# EAGLE design TPLE (EAGLE 5.06)
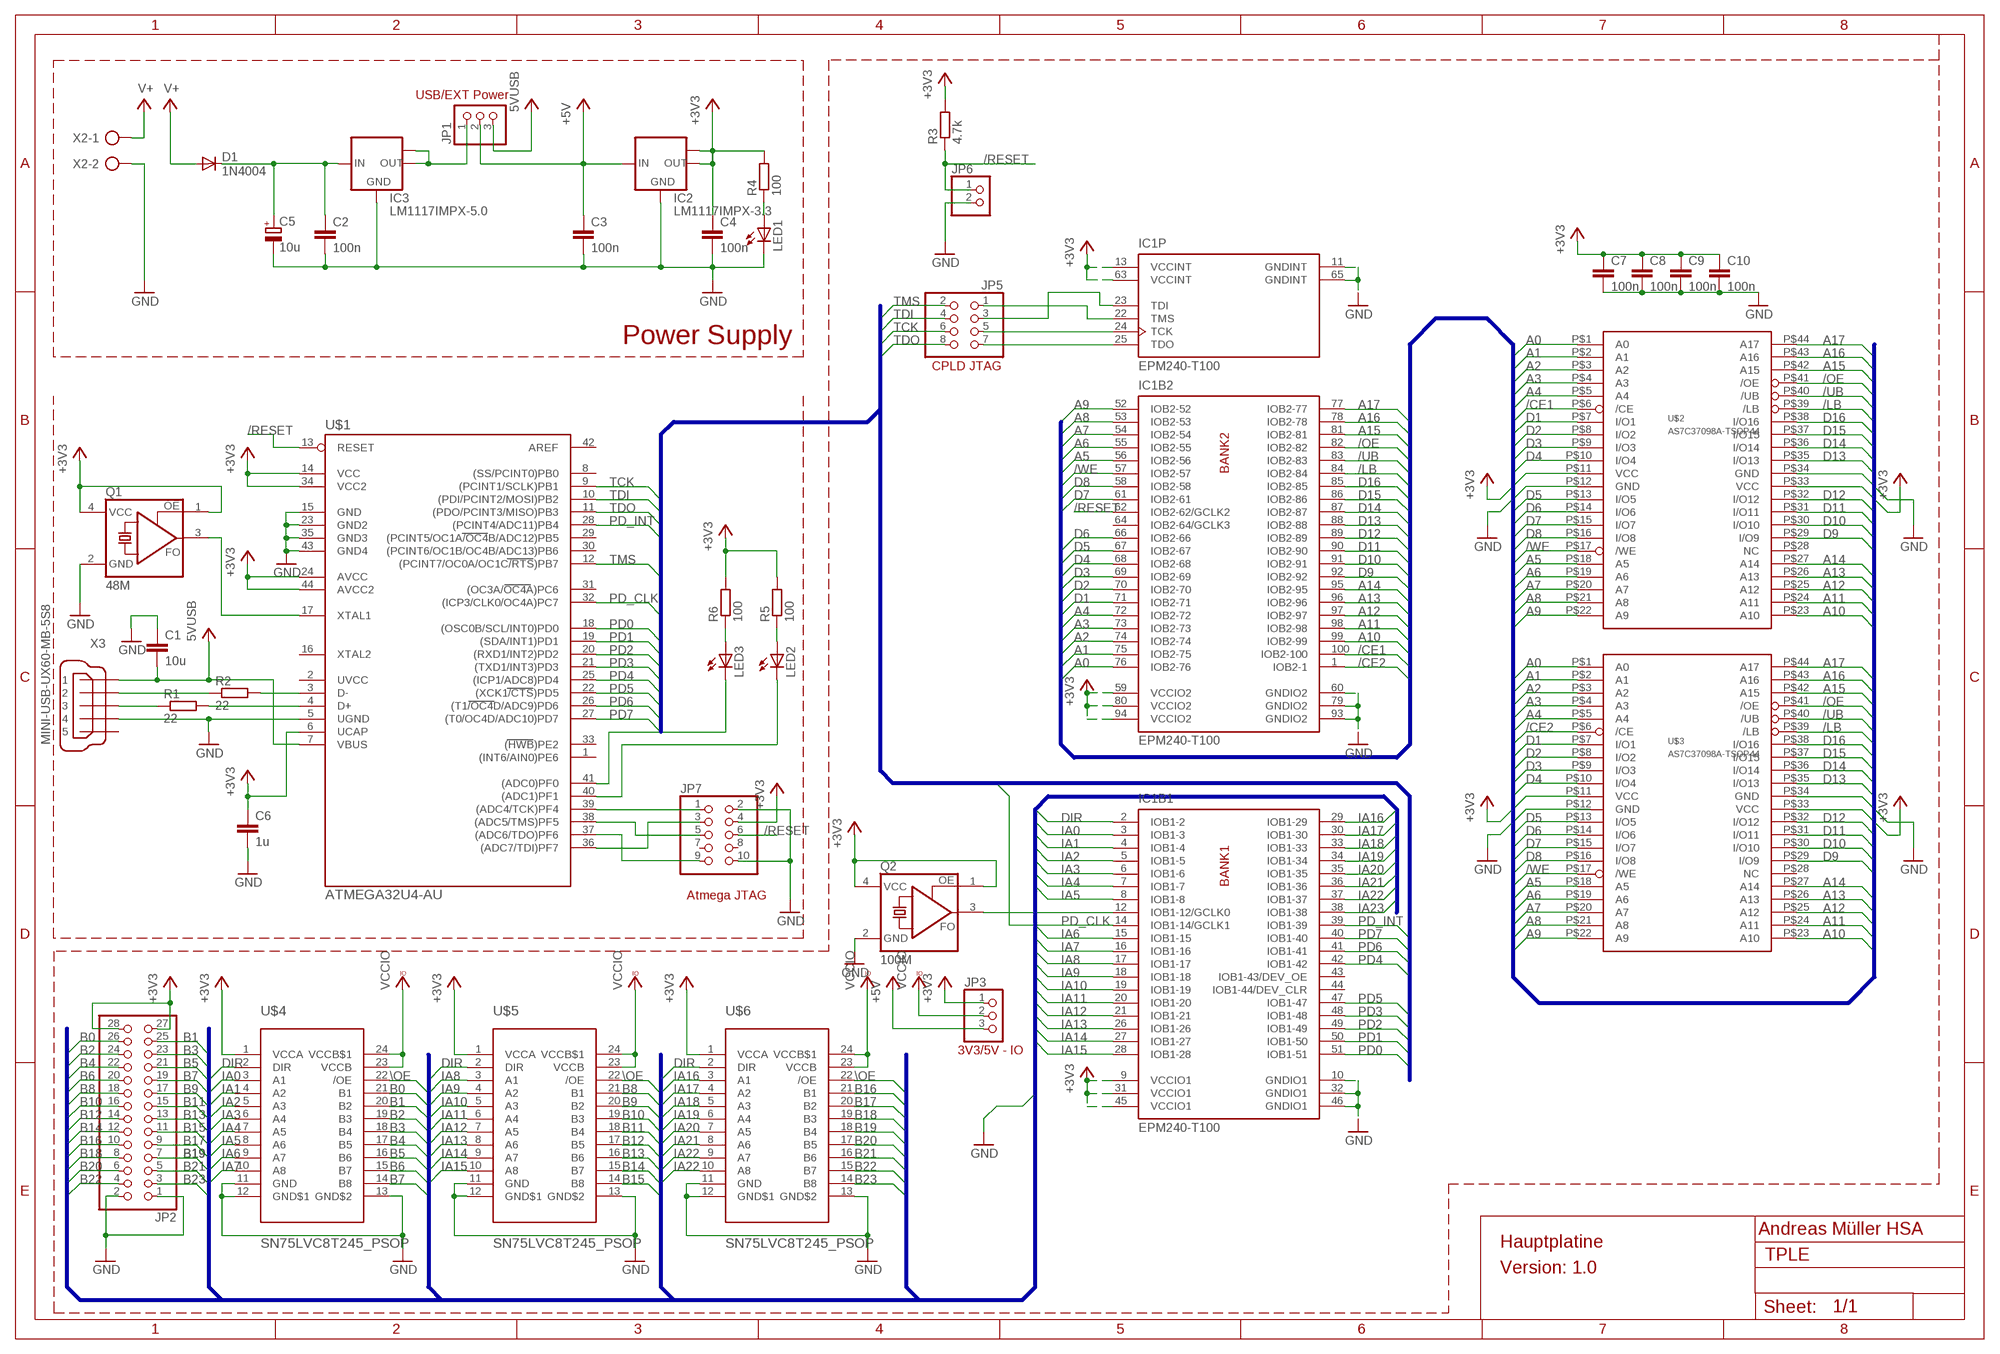
[diagram p0: schematic, sheet 1]

## Parts
C1  10u  C-EUC3216  [C3216]
C2  100n  C-EUC1206  [C1206]
C3  100n  C-EUC1206  [C1206]
C4  100n  C-EUC1206  [C1206]
C5  10u  CPOL-EU153CLV-1012  [153CLV-1012]
C6  1u  C-EUC0402  [C0402]
C7  100n  C-EUC0402  [C0402]
C8  100n  C-EUC0402  [C0402]
C9  100n  C-EUC0402  [C0402]
C10  100n  C-EUC0402  [C0402]
D1  1N4004  [DO41-10]
IC1  EPM240-T100  [TQFP100]
IC2  LM1117IMPX-3.3  [SOT223]
IC3  LM1117IMPX-5.0  [SOT223]
JP1  PINHD-1X3  [1X03]
JP2  PINHD-2X14  [2X14]
JP3  PINHD-1X3  [1X03]
JP5  PINHD-2X4  [2X04]
JP6  PINHD-1X2  [1X02]
JP7  PINHD-2X5  [2X05]
LED1  LEDSMT1206  [1206]
LED2  LEDSMT1206  [1206]
LED3  LEDSMT1206  [1206]
Q1  48M  ASFL1  [ASF]
Q2  100M  ASFL1  [ASF]
R1  22  R-EU_M3216  [M3216]
R2  22  R-EU_M3216  [M3216]
R3  4.7k  R-EU_M3216  [M3216]
R4  100  R-EU_M3216  [M3216]
R5  100  R-EU_M3216  [M3216]
R6  100  R-EU_M3216  [M3216]
U$1  ATMEGA32U4-AU  [TQFP44]
U$2  AS7C37098A-TSOP44  [TSOP2-44]
U$3  AS7C37098A-TSOP44  [TSOP2-44]
U$4  SN75LVC8T245_PSOP  [SOP24]
U$5  SN75LVC8T245_PSOP  [SOP24]
U$6  SN75LVC8T245_PSOP  [SOP24]
X2  AK300/2  [AK300/2]
X3  MINI-USB-UX60-MB-5S8  [UX60-MB-5S8]

## Nets
+3V3: C4.1 C6.1 C7.1 C8.1 C9.1 C10.1 IC1.9(B1:VCCIO1) IC1.13(P:VCCINT) IC1.31(B1:VCCIO1) IC1.45(B1:VCCIO1) IC1.59(B2:VCCIO2) IC1.63(P:VCCINT) IC1.80(B2:VCCIO2) IC1.94(B2:VCCIO2) IC2.2(OUT) IC2.TAB(OUT1) JP2.27 JP2.28 JP3.1 JP7.4 Q1.1(OE) Q1.4(VCC) Q2.1(OE) Q2.4(VCC) R3.2 R4.2 R5.2 R6.2 U$1.6(UCAP) U$1.14(VCC) U$1.24(AVCC) U$1.34(VCC2) U$1.44(AVCC2) U$2.P$11(VCC) U$2.P$33(VCC) U$3.P$11(VCC) U$3.P$33(VCC) U$4.1(VCCA) U$5.1(VCCA) U$6.1(VCCA)
+5V: C3.1 IC2.3(IN) JP1.2 JP3.3
/CE1: IC1.100(B2:IOB2-100) U$2.P$6(/CE)
/CE2: IC1.1(B2:IOB2-1) U$3.P$6(/CE)
/LB: IC1.84(B2:IOB2-84) U$2.P$39(/LB) U$3.P$39(/LB)
/OE: IC1.82(B2:IOB2-82) U$2.P$41(/OE) U$3.P$41(/OE)
/RESET: IC1.62(B2:IOB2-62/GCLK2) JP6.1 JP7.6 R3.1 U$1.13(RESET)
/UB: IC1.83(B2:IOB2-83) U$2.P$40(/UB) U$3.P$40(/UB)
/WE: IC1.57(B2:IOB2-57) U$2.P$17(/WE) U$3.P$17(/WE)
\OE: U$4.22(/OE) U$5.22(/OE) U$6.22(/OE)
A0: IC1.76(B2:IOB2-76) U$2.P$1(A0) U$3.P$1(A0)
A1: IC1.75(B2:IOB2-75) U$2.P$2(A1) U$3.P$2(A1)
A2: IC1.74(B2:IOB2-74) U$2.P$3(A2) U$3.P$3(A2)
A3: IC1.73(B2:IOB2-73) U$2.P$4(A3) U$3.P$4(A3)
A4: IC1.72(B2:IOB2-72) U$2.P$5(A4) U$3.P$5(A4)
A5: IC1.56(B2:IOB2-56) U$2.P$18(A5) U$3.P$18(A5)
A6: IC1.55(B2:IOB2-55) U$2.P$19(A6) U$3.P$19(A6)
A7: IC1.54(B2:IOB2-54) U$2.P$20(A7) U$3.P$20(A7)
A8: IC1.53(B2:IOB2-53) U$2.P$21(A8) U$3.P$21(A8)
A9: IC1.52(B2:IOB2-52) U$2.P$22(A9) U$3.P$22(A9)
A10: IC1.99(B2:IOB2-99) U$2.P$23(A10) U$3.P$23(A10)
A11: IC1.98(B2:IOB2-98) U$2.P$24(A11) U$3.P$24(A11)
A12: IC1.97(B2:IOB2-97) U$2.P$25(A12) U$3.P$25(A12)
A13: IC1.96(B2:IOB2-96) U$2.P$26(A13) U$3.P$26(A13)
A14: IC1.95(B2:IOB2-95) U$2.P$27(A14) U$3.P$27(A14)
A15: IC1.81(B2:IOB2-81) U$2.P$42(A15) U$3.P$42(A15)
A16: IC1.78(B2:IOB2-78) U$2.P$43(A16) U$3.P$43(A16)
A17: IC1.77(B2:IOB2-77) U$2.P$44(A17) U$3.P$44(A17)
B0: JP2.26 U$4.21(B1)
B1: JP2.25 U$4.20(B2)
B2: JP2.24 U$4.19(B3)
B3: JP2.23 U$4.18(B4)
B4: JP2.22 U$4.17(B5)
B5: JP2.21 U$4.16(B6)
B6: JP2.20 U$4.15(B7)
B7: JP2.19 U$4.14(B8)
B8: JP2.18 U$5.21(B1)
B9: JP2.17 U$5.20(B2)
B10: JP2.16 U$5.19(B3)
B11: JP2.15 U$5.18(B4)
B12: JP2.14 U$5.17(B5)
B13: JP2.13 U$5.16(B6)
B14: JP2.12 U$5.15(B7)
B15: JP2.11 U$5.14(B8)
B16: JP2.10 U$6.21(B1)
B17: JP2.9 U$6.20(B2)
B18: JP2.8 U$6.19(B3)
B19: JP2.7 U$6.18(B4)
B20: JP2.6 U$6.17(B5)
B21: JP2.5 U$6.16(B6)
B22: JP2.4 U$6.15(B7)
B23: JP2.3 U$6.14(B8)
D1: IC1.71(B2:IOB2-71) U$2.P$7(I/O1) U$3.P$7(I/O1)
D2: IC1.70(B2:IOB2-70) U$2.P$8(I/O2) U$3.P$8(I/O2)
D3: IC1.69(B2:IOB2-69) U$2.P$9(I/O3) U$3.P$9(I/O3)
D4: IC1.68(B2:IOB2-68) U$2.P$10(I/O4) U$3.P$10(I/O4)
D5: IC1.67(B2:IOB2-67) U$2.P$13(I/O5) U$3.P$13(I/O5)
D6: IC1.66(B2:IOB2-66) U$2.P$14(I/O6) U$3.P$14(I/O6)
D7: IC1.61(B2:IOB2-61) U$2.P$15(I/O7) U$3.P$15(I/O7)
D8: IC1.58(B2:IOB2-58) U$2.P$16(I/O8) U$3.P$16(I/O8)
D9: IC1.92(B2:IOB2-92) U$2.P$29(I/O9) U$3.P$29(I/O9)
D10: IC1.91(B2:IOB2-91) U$2.P$30(I/O10) U$3.P$30(I/O10)
D11: IC1.90(B2:IOB2-90) U$2.P$31(I/O11) U$3.P$31(I/O11)
D12: IC1.89(B2:IOB2-89) U$2.P$32(I/O12) U$3.P$32(I/O12)
D13: IC1.88(B2:IOB2-88) U$2.P$35(I/O13) U$3.P$35(I/O13)
D14: IC1.87(B2:IOB2-87) U$2.P$36(I/O14) U$3.P$36(I/O14)
D15: IC1.86(B2:IOB2-86) U$2.P$37(I/O15) U$3.P$37(I/O15)
D16: IC1.85(B2:IOB2-85) U$2.P$38(I/O16) U$3.P$38(I/O16)
DIR: IC1.2(B1:IOB1-2) U$4.2(DIR) U$5.2(DIR) U$6.2(DIR)
GND: C1.1 C2.2 C3.2 C4.2 C5.- C6.2 C7.2 C8.2 C9.2 C10.2 IC1.10(B1:GNDIO1) IC1.11(P:GNDINT) IC1.32(B1:GNDIO1) IC1.46(B1:GNDIO1) IC1.60(B2:GNDIO2) IC1.65(P:GNDINT) IC1.79(B2:GNDIO2) IC1.93(B2:GNDIO2) IC2.1(GND) IC3.1(GND) JP2.1 JP2.2 JP6.2 JP7.2 JP7.10 LED1.C Q1.2(GND) Q2.2(GND) U$1.5(UGND) U$1.15(GND) U$1.23(GND2) U$1.35(GND3) U$1.43(GND4) U$2.P$12(GND) U$2.P$34(GND) U$3.P$34(GND) U$4.11(GND) U$4.12(GND$1) U$4.13(GND$2) U$5.11(GND) U$5.12(GND$1) U$5.13(GND$2) U$6.11(GND) U$6.12(GND$1) U$6.13(GND$2) X2.2 X3.4
IA0: IC1.3(B1:IOB1-3) U$4.3(A1)
IA1: IC1.4(B1:IOB1-4) U$4.4(A2)
IA2: IC1.5(B1:IOB1-5) U$4.5(A3)
IA3: IC1.6(B1:IOB1-6) U$4.6(A4)
IA4: IC1.7(B1:IOB1-7) U$4.7(A5)
IA5: IC1.8(B1:IOB1-8) U$4.8(A6)
IA6: IC1.15(B1:IOB1-15) U$4.9(A7)
IA7: IC1.16(B1:IOB1-16) U$4.10(A8)
IA8: IC1.17(B1:IOB1-17) U$5.3(A1)
IA9: IC1.18(B1:IOB1-18) U$5.4(A2)
IA10: IC1.19(B1:IOB1-19) U$5.5(A3)
IA11: IC1.20(B1:IOB1-20) U$5.6(A4)
IA12: IC1.21(B1:IOB1-21) U$5.7(A5)
IA13: IC1.26(B1:IOB1-26) U$5.8(A6)
IA14: IC1.27(B1:IOB1-27) U$5.9(A7)
IA15: IC1.28(B1:IOB1-28) U$5.10(A8)
IA16: IC1.29(B1:IOB1-29) U$6.3(A1)
IA17: IC1.30(B1:IOB1-30) U$6.4(A2)
IA18: IC1.33(B1:IOB1-33) U$6.5(A3)
IA19: IC1.34(B1:IOB1-34) U$6.6(A4)
IA20: IC1.35(B1:IOB1-35) U$6.7(A5)
IA21: IC1.36(B1:IOB1-36) U$6.8(A6)
IA22: IC1.37(B1:IOB1-37) U$6.9(A7)
IA23: IC1.38(B1:IOB1-38) U$6.10(A8)
N$2: R2.1 X3.2
N$3: R2.2 U$1.3(D-)
N$4: R1.1 X3.3
N$5: R1.2 U$1.4(D+)
N$6: IC3.2(OUT) IC3.TAB(OUT1) JP1.1
N$7: IC1.23(P:TDI) JP5.3
N$8: C2.1 C5.+ D1.C IC3.3(IN)
N$9: IC1.22(P:TMS) JP5.1
N$10: IC1.24(P:TCK) JP5.5
N$11: IC1.25(P:TDO) JP5.7
N$13: JP7.1 U$1.39((ADC4/TCK)PF4)
N$14: JP7.3 U$1.36((ADC7/TDI)PF7)
N$15: JP7.5 U$1.38((ADC5/TMS)PF5)
N$16: JP7.9 U$1.37((ADC6/TDO)PF6)
N$23: Q1.3(FO) U$1.17(XTAL1)
N$24: IC1.12(B1:IOB1-12/GCLK0) Q2.3(FO)
N$25: LED1.A R4.1
N$26: LED2.C U$1.40((ADC1)PF1)
N$27: LED3.C U$1.41((ADC0)PF0)
N$28: LED2.A R5.1
N$29: LED3.A R6.1
PD0: IC1.51(B1:IOB1-51) U$1.18((OSC0B/SCL/INT0)PD0)
PD1: IC1.50(B1:IOB1-50) U$1.19((SDA/INT1)PD1)
PD2: IC1.49(B1:IOB1-49) U$1.20((RXD1/INT2)PD2)
PD3: IC1.48(B1:IOB1-48) U$1.21((TXD1/INT3)PD3)
PD4: IC1.42(B1:IOB1-42) U$1.25((ICP1/ADC8)PD4)
PD5: IC1.47(B1:IOB1-47) U$1.22((XCK1/CTS)PD5)
PD6: IC1.41(B1:IOB1-41) U$1.26((T1/OC4D/ADC9)PD6)
PD7: IC1.40(B1:IOB1-40) U$1.27((T0/OC4D/ADC10)PD7)
PD_CLK: IC1.14(B1:IOB1-14/GCLK1) U$1.32((ICP3/CLK0/OC4A)PC7)
PD_INT: IC1.39(B1:IOB1-39) U$1.28((PCINT4/ADC11)PB4)
TCK: JP5.6 U$1.9((PCINT1/SCLK)PB1)
TDI: JP5.4 U$1.10((PDI/PCINT2/MOSI)PB2)
TDO: JP5.8 U$1.11((PDO/PCINT3/MISO)PB3)
TMS: JP5.2 U$1.12((PCINT7/OC0A/OC1C/RTS)PB7)
V+: D1.A X2.1
VCC: C1.2 JP1.3 U$1.7(VBUS) X3.1 ; supply symbol labelled 5VUSB
VCCIO: JP3.2 U$4.23(VCCB) U$4.24(VCCB$1) U$5.23(VCCB) U$5.24(VCCB$1) U$6.23(VCCB) U$6.24(VCCB$1)
Unconnected: IC1.43(B1:IOB1-43/DEV_OE) IC1.44(B1:IOB1-44/DEV_CLR) IC1.64(B2:IOB2-64/GCLK3) JP7.7 JP7.8 U$1.1((INT6/AIN0)PE6) U$1.2(UVCC) U$1.8((SS/PCINT0)PB0) U$1.16(XTAL2) U$1.29((PCINT5/OC1A/OC4B/ADC12)PB5) U$1.30((PCINT6/OC1B/OC4B/ADC13)PB6) U$1.31((OC3A/OC4A)PC6) U$1.33((HWB)PE2) U$1.42(AREF) U$2.P$28(NC) U$3.P$28(NC) X3.5

## Buses
A[0..17],D[1..16],/WE,/LB,/UB,/OE,/CE1,/CE2
PD[0..7],PD_CLK,PD_INT,TDI,TMS,TCK,TDO
IA[0..23],B[0..23],DIR,\OE

## Notes on the sheet
- USB/EXT Power
- Power Supply
- CPLD JTAG
- Atmega JTAG
- 3V3/5V - IO
- Andreas Müller HSA
- Hauptplatine
- Version: 1.0

## Power pins joined to a net without a drawn wire
GND: U$3.P$12(GND)

## Library data of the parts
C1-C4 C6-C10 = rcl:C-EU: CAPACITOR, European symbol
C5 = rcl:CPOL-EU: POLARIZED CAPACITOR, European symbol
D1 = diode:1N4004: DIODE general purpose rectifier, 1 A
IC1 = altera-max2:EPM240-T100: Altera MAX II CPLD - EPM240 TQFP-100 Device EPM240 from Altera MAX II Family Feature EPM240 LEs 240 Typical Equivalent Macrocells 192 Equivalent Macrocell Range 128 ... 240 UFM Size (bits) 8192 User I/O pins 80 tPD1 (ns) 4.7 fCNT (MHz) 304 tSU (ns) 1.7 tCO (ns) 4.3
IC2 IC3 = lm1117:LM1117IMPX-*
JP1 JP3 = pinhead:PINHD-1X3: PIN HEADER
JP2 = pinhead:PINHD-2X14: PIN HEADER
JP5 = pinhead:PINHD-2X4: PIN HEADER
JP6 = pinhead:PINHD-1X2: PIN HEADER
JP7 = pinhead:PINHD-2X5: PIN HEADER
LED1-LED3 = led:LED: LED OSRAM: - CHIPLED LG R971, LG N971, LY N971, LG Q971, LY Q971, LO R971, LY R971 LH N974, LH R974 LS Q976, LO Q976, LY Q976 LO Q996 - Hyper CHIPLED LW Q18S LB Q993, LB Q99A, LB R99A - SideLED LS A670, LO A670, LY A670, LG A670, LP A670 LB A673, LV A673, LT A673, LW A673 LH A674 LY A675 LS A676, LA A676, LO A676, LY A676, LW A676 LS A679, LY A679, LG A679 - Hyper Micro SIDELED® LS Y876, LA Y876, LO Y876, LY Y876 LT Y87S - SmartLED LW L88C, LW L88S LB L89C, LB L89S, LG L890 LS L89K, LO L89K, LY L89K LS L896, LA L896, LO L896, LY L896 - TOPLED LS T670, LO T670, LY T670, LG T670, LP T670 LSG T670, LSP T670, LSY T670, LOP T670, LYG T670 LG T671, LOG T671, LSG T671 LB T673, LV T673, LT T673, LW T673 LH T674 LS T676, LA T676, LO T676, LY T676, LB T676, LH T676, LSB T676, LW T676 LB T67C, LV T67C, LT T67C, LS T67K, LO T67K, LY T67K, LW E67C LS E67B, LA E67B, LO E67B, LY E67B, LB E67C, LV E67C, LT E67C LW T67C LS T679, LY T679, LG T679 LS T770, LO T770, LY T770, LG T770, LP T770 LB T773, LV T773, LT T773, LW T773 LH T774 LS E675, LA E675, LY E675, LS T675 LS T776, LA T776, LO T776, LY T776, LB T776 LHGB T686 LT T68C, LB T68C - Hyper Mini TOPLED® LB M676 - Mini TOPLED Santana® LG M470 LS M47K, LO M47K, LY M47K Source: http://www.osram.convergy.de LUXEON: - LUMILED® LXK2-PW12-R00, LXK2-PW12-S00, LXK2-PW14-U00, LXK2-PW14-V00 LXK2-PM12-R00, LXK2-PM12-S00, LXK2-PM14-U00 LXK2-PE12-Q00, LXK2-PE12-R00, LXK2-PE12-S00, LXK2-PE14-T00, LXK2-PE14-U00 LXK2-PB12-K00, LXK2-PB12-L00, LXK2-PB12-M00, LXK2-PB14-N00, LXK2-PB14-P00, LXK2-PB14-Q00 LXK2-PR12-L00, LXK2-PR12-M00, LXK2-PR14-Q00, LXK2-PR14-R00 LXK2-PD12-Q00, LXK2-PD12-R00, LXK2-PD12-S00 LXK2-PH12-R00, LXK2-PH12-S00 LXK2-PL12-P00, LXK2-PL12-Q00, LXK2-PL12-R00 Source: www.luxeon.com KINGBRIGHT: KA-3528ASYC Source: www.kingbright.com
Q1 Q2 = crystal:ASF*: CRYSTAL CLOCK OSCILLATORS 5.0 Vdc or 3.3 Vdc - LOW PROFILE ULTRA MINIATURE CERAMIC SURFACE MOUNT Source: http://www.abracon.com/Oscillators/asf1-L-L1.pdf
R1-R6 = resistor:R-EU_: RESISTOR, European symbol
U$1 = mega32U4:ATMEGA32U4-AU
U$2 U$3 = Alliance_Memory:AS7C37098A-TSOP44
U$4-U$6 = SN74LVC:SN75LVC8T245_PSOP
X2 = con-ptr500:AK300/2: CONNECTOR
X3 = con-hirose:MINI-USB-: MINI USB Connector Source: http://www.hirose.co.jp/cataloge_hp/e24000019.pdf

## Board
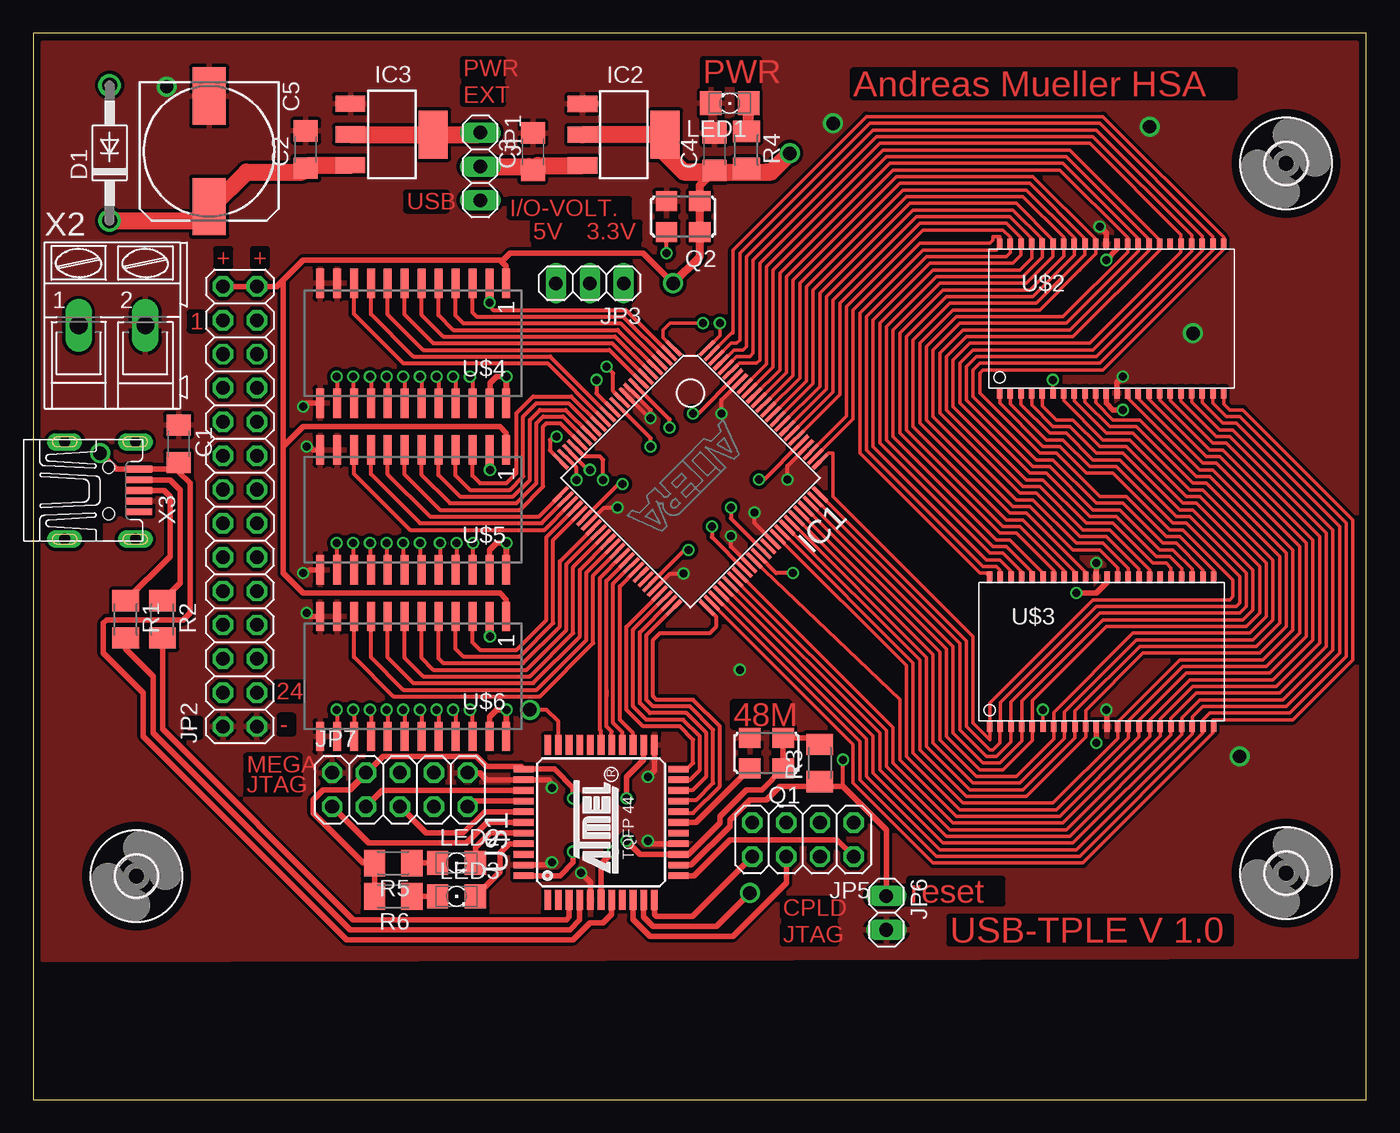
[diagram p1: board, top side]
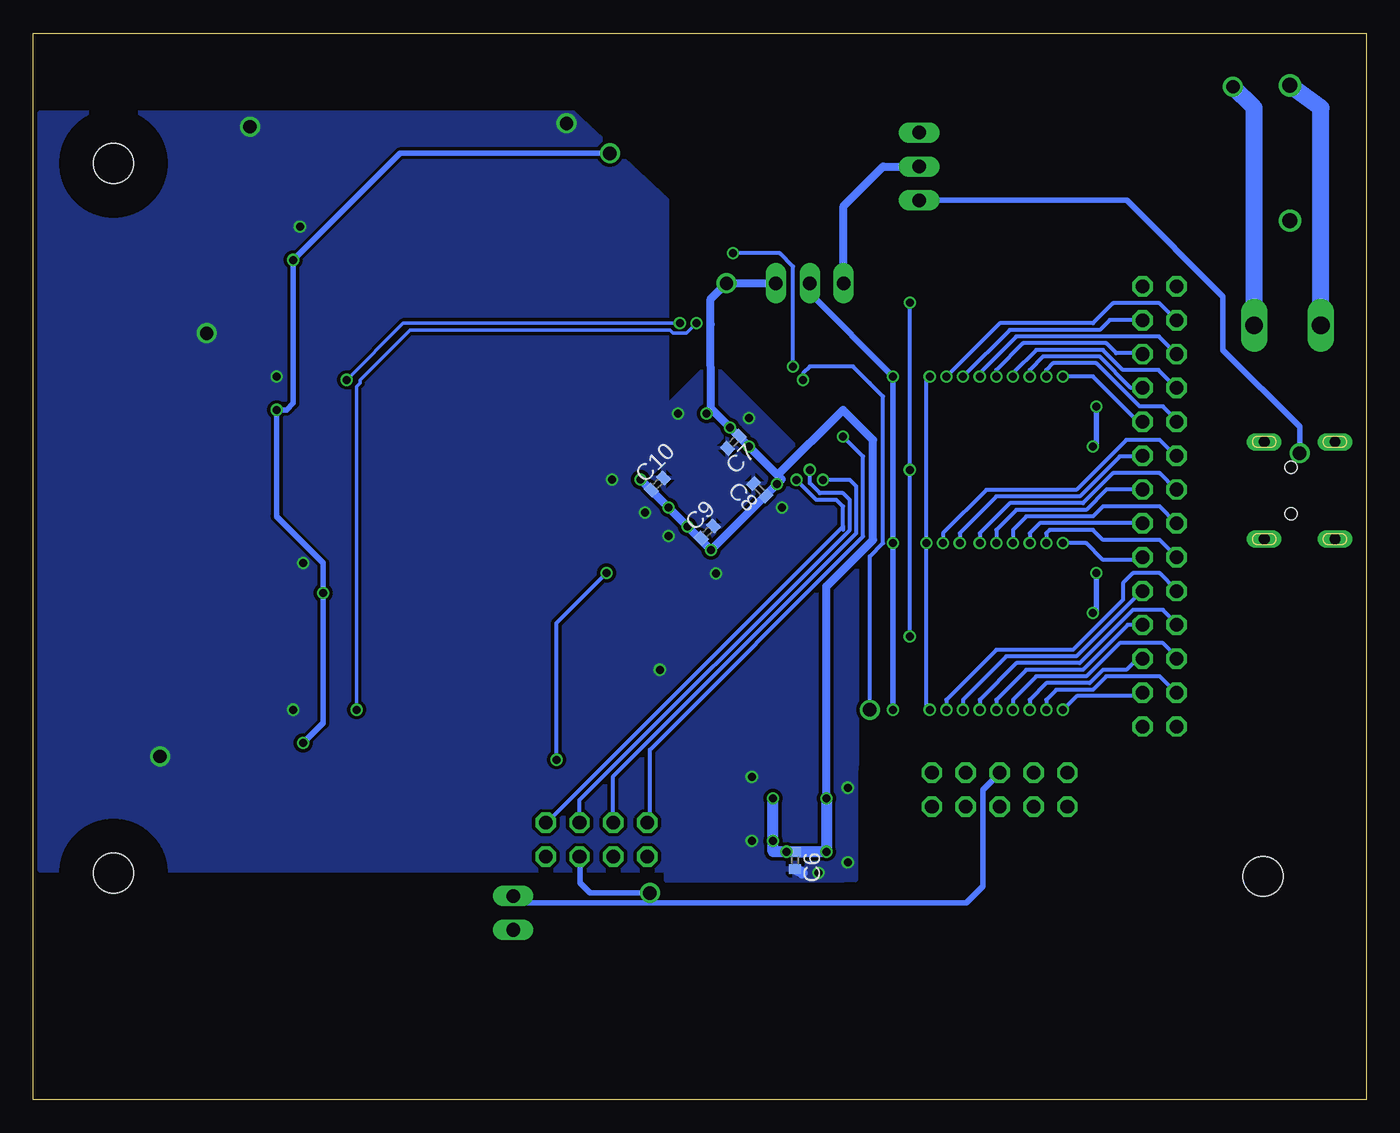
[diagram p2: board, bottom side, seen from below]

Size 100 x 80 mm. Coordinates in mm from the lower left corner, seen from the top.
Outline: 0,0 100,0 100,80 0,80 0,0
Copper layers (1*16): Top 0.035mm / dielectric 1.5mm / Bottom 0.035mm
Design rules "PropagandaPCB *": minimum track width 10mil, minimum drill 10mil, track to track 10mil, track to pad 10mil, pad to pad 10mil, via to via 10mil, smd to smd 20mil, copper to edge 10mil, drill to drill 10mil, minimum pad ring 10mil, minimum via ring 6mil, stop-mask expansion 2mil, vias tented up to drill 100mil, thermal gap 10mil

### Footprints (pad centres in the part's own frame; a part is rotated, then mirrored left to right if it is on the bottom)
C3216 = smd 1.6 x 1.8: 1 -1.4,0; 2 1.4,0
C1206 = smd 1.6 x 1.8: 1 -1.4,0; 2 1.4,0
153CLV-1012 = smd 4.3 x 2.5: + 4.15,0; - -4.15,0
C0402 = smd 0.7 x 0.9: 1 -0.65,0; 2 0.65,0
DO41-10 = drill 1.118 round: A 5.08,0; C -5.08,0
TQFP100 = smd 0.27 x 1.5: 1 -6,-7.75; 2 -5.5,-7.75; 3 -5,-7.75; 4 -4.5,-7.75; 5 -4,-7.75; 6 -3.5,-7.75; 7 -3,-7.75; 8 -2.5,-7.75; 9 -2,-7.75; 10 -1.5,-7.75; 11 -1,-7.75; 12 -0.5,-7.75; 13 0,-7.75; 14 0.5,-7.75; 15 1,-7.75; 16 1.5,-7.75; 17 2,-7.75; 18 2.5,-7.75; 19 3,-7.75; 20 3.5,-7.75; 21 4,-7.75; 22 4.5,-7.75; 23 5,-7.75; 24 5.5,-7.75; 25 6,-7.75; 51 6,7.75; 52 5.5,7.75; 53 5,7.75; 54 4.5,7.75; 55 4,7.75; 56 3.5,7.75; 57 3,7.75; 58 2.5,7.75; 59 2,7.75; 60 1.5,7.75; 61 1,7.75; 62 0.5,7.75; 63 0,7.75; 64 -0.5,7.75; 65 -1,7.75; 66 -1.5,7.75; 67 -2,7.75; 68 -2.5,7.75; 69 -3,7.75; 70 -3.5,7.75; 71 -4,7.75; 72 -4.5,7.75; 73 -5,7.75; 74 -5.5,7.75; 75 -6,7.75 | smd 1.5 x 0.27: 26 7.75,-6; 27 7.75,-5.5; 28 7.75,-5; 29 7.75,-4.5; 30 7.75,-4; 31 7.75,-3.5; 32 7.75,-3; 33 7.75,-2.5; 34 7.75,-2; 35 7.75,-1.5; 36 7.75,-1; 37 7.75,-0.5; 38 7.75,0; 39 7.75,0.5; 40 7.75,1; 41 7.75,1.5; 42 7.75,2; 43 7.75,2.5; 44 7.75,3; 45 7.75,3.5; 46 7.75,4; 47 7.75,4.5; 48 7.75,5; 49 7.75,5.5; 50 7.75,6; 76 -7.75,6; 77 -7.75,5.5; 78 -7.75,5; 79 -7.75,4.5; 80 -7.75,4; 81 -7.75,3.5; 82 -7.75,3; 83 -7.75,2.5; 84 -7.75,2; 85 -7.75,1.5; 86 -7.75,1; 87 -7.75,0.5; 88 -7.75,0; 89 -7.75,-0.5; 90 -7.75,-1; 91 -7.75,-1.5; 92 -7.75,-2; 93 -7.75,-2.5; 94 -7.75,-3; 95 -7.75,-3.5; 96 -7.75,-4; 97 -7.75,-4.5; 98 -7.75,-5; 99 -7.75,-5.5; 100 -7.75,-6
SOT223 = smd 1.219 x 2.235: 1 -2.311,-3.099; 2 0,-3.099; 3 2.311,-3.099 | smd 3.6 x 2.2: TAB 0,3.099
1X03 = drill 1.016 long: 1 -2.54,0; 2 0,0; 3 2.54,0
2X14 = drill 1.016 octagon: 1 -16.51,-1.27; 2 -16.51,1.27; 3 -13.97,-1.27; 4 -13.97,1.27; 5 -11.43,-1.27; 6 -11.43,1.27; 7 -8.89,-1.27; 8 -8.89,1.27; 9 -6.35,-1.27; 10 -6.35,1.27; 11 -3.81,-1.27; 12 -3.81,1.27; 13 -1.27,-1.27; 14 -1.27,1.27; 15 1.27,-1.27; 16 1.27,1.27; 17 3.81,-1.27; 18 3.81,1.27; 19 6.35,-1.27; 20 6.35,1.27; 21 8.89,-1.27; 22 8.89,1.27; 23 11.43,-1.27; 24 11.43,1.27; 25 13.97,-1.27; 26 13.97,1.27; 27 16.51,-1.27; 28 16.51,1.27
2X04 = drill 1.016 octagon: 1 -3.81,-1.27; 2 -3.81,1.27; 3 -1.27,-1.27; 4 -1.27,1.27; 5 1.27,-1.27; 6 1.27,1.27; 7 3.81,-1.27; 8 3.81,1.27
1X02 = drill 1.016 long: 1 -1.27,0; 2 1.27,0
2X05 = drill 1.016 octagon: 1 -5.08,-1.27; 2 -5.08,1.27; 3 -2.54,-1.27; 4 -2.54,1.27; 5 0,-1.27; 6 0,1.27; 7 2.54,-1.27; 8 2.54,1.27; 9 5.08,-1.27; 10 5.08,1.27
1206 = smd 1.6 x 1.803: A -1.422,0; C 1.422,0
ASF = smd 1.6 x 1.5: 1 -1.25,-1.15; 2 1.25,-1.15; 3 1.25,1.15; 4 -1.25,1.15
M3216 = smd 1.6 x 2: 1 -1.4,0; 2 1.4,0
TQFP44 = smd 1.5 x 0.5: 1 -5.8,4; 2 -5.8,3.2; 3 -5.8,2.4; 4 -5.8,1.6; 5 -5.8,0.8; 6 -5.8,0; 7 -5.8,-0.8; 8 -5.8,-1.6; 9 -5.8,-2.4; 10 -5.8,-3.2; 11 -5.8,-4; 23 5.8,-4; 24 5.8,-3.2; 25 5.8,-2.4; 26 5.8,-1.6; 27 5.8,-0.8; 28 5.8,0; 29 5.8,0.8; 30 5.8,1.6; 31 5.8,2.4; 32 5.8,3.2; 33 5.8,4 | smd 0.5 x 1.5: 12 -4,-5.8; 13 -3.2,-5.8; 14 -2.4,-5.8; 15 -1.6,-5.8; 16 -0.8,-5.8; 17 0,-5.8; 18 0.8,-5.8; 19 1.6,-5.8; 20 2.4,-5.8; 21 3.2,-5.8; 22 4,-5.8; 34 4,5.8; 35 3.2,5.8; 36 2.4,5.8; 37 1.6,5.8; 38 0.8,5.8; 39 0,5.8; 40 -0.8,5.8; 41 -1.6,5.8; 42 -2.4,5.8; 43 -3.2,5.8; 44 -4,5.8
TSOP2-44 = smd 0.406 x 0.813: P$1 0,0; P$2 0.8,0; P$3 1.6,0; P$4 2.4,0; P$5 3.2,0; P$6 4,0; P$7 4.8,0; P$8 5.6,0; P$9 6.4,0; P$10 7.2,0; P$11 8,0; P$12 8.8,0; P$13 9.6,0; P$14 10.4,0; P$15 11.2,0; P$16 12,0; P$17 12.8,0; P$18 13.6,0; P$19 14.4,0; P$20 15.2,0; P$21 16,0; P$22 16.8,0; P$23 16.8,11.2; P$24 16,11.2; P$25 15.2,11.2; P$26 14.4,11.2; P$27 13.6,11.2; P$28 12.8,11.2; P$29 12,11.2; P$30 11.2,11.2; P$31 10.4,11.2; P$32 9.6,11.2; P$33 8.8,11.2; P$34 8,11.2; P$35 7.2,11.2; P$36 6.4,11.2; P$37 5.6,11.2; P$38 4.8,11.2; P$39 4,11.2; P$40 3.2,11.2; P$41 2.4,11.2; P$42 1.6,11.2; P$43 0.8,11.2; P$44 0,11.2
SOP24 = smd 0.6 x 2.2: 1 -6.985,-4.5; 2 -5.715,-4.5; 3 -4.445,-4.5; 4 -3.175,-4.5; 5 -1.905,-4.5; 6 -0.635,-4.5; 7 0.635,-4.5; 8 1.905,-4.5; 9 3.175,-4.5; 10 4.445,-4.5; 11 5.715,-4.5; 12 6.985,-4.5; 13 6.985,4.5; 14 5.715,4.5; 15 4.445,4.5; 16 3.175,4.5; 17 1.905,4.5; 18 0.635,4.5; 19 -0.635,4.5; 20 -1.905,4.5; 21 -3.175,4.5; 22 -4.445,4.5; 23 -5.715,4.5; 24 -6.985,4.5
3,0 = hole 3: 0,0
AK300/2 = drill 1.321 long: 1 -2.515,0; 2 2.489,0
UX60-MB-5S8 = smd 2 x 0.5: 1 8.65,1.6; 2 8.65,0.8; 3 8.65,0; 4 8.65,-0.8; 5 8.65,-1.6 | drill 0.8 long: M1 3.1,-3.65; M2 3.1,3.65; M3 8.4,3.65; M4 8.4,-3.65 | hole 0.9: 6.4,-1.75; 6.4,1.75

### Placement (x,y rotation side)
C1  10.9,49.2 270 top
C2  20.44,71.28 90 top
C3  37.48,71.12 90 top
C4  51.12,71.12 90 top
C5  13.19,71.14 270 top
C6  42.84,17.95 270 bottom
C7  47.47,49.32 225 bottom
C8  45.5,45.75 135 bottom
C9  49.43,42.57 45 bottom
C10  53.18,46.18 45 bottom
D1  5.72,71.02 90 top
IC1  49.3,46.64 225 top
IC2  44.3,72.39 270 top
IC3  26.89,72.41 270 top
JP1  33.53,70.01 270 top
JP2  15.5,44.5 90 top
JP3  41.75,61.25 180 top
JP5  57.75,19.5 180 top
JP6  64,14 270 top
JP7  27.5,23.25 0 top
LED1  52.25,74.75 180 top
LED2  31.75,17.75 0 top
LED3  31.75,15.25 0 top
Q1  55,26 180 top
Q2  48.75,66.25 180 top
R1  6.93,36.03 270 top
R2  9.69,36.03 270 top
R3  59,25.25 90 top
R4  53.5,71.25 270 top
R5  27,17.75 180 top
R6  27,15.25 180 top
U$1  42.59,20.8 90 top
U$2  72.5,53 0 top
U$3  71.75,28 0 top
U$4  28.5,56.75 180 top
U$5  28.5,44.25 180 top
U$6  28.5,31.75 180 top
U$7  [3,0]  7.75,16.75 0 top
U$8  [3,0]  94,17 0 top
U$9  [3,0]  94,70.25 0 top
X2  5.92,58.08 0 top
X3  -0.75,45.7 0 top

### Tracks (layer width: path | path; a pad name or v marks a point on that pad's centre or on a via)
+3V3  (via drill 0.6, 1)
  Top 0.254: 80.55,38.8 U$3.P$33
  Top 0.305: IC1.80 54.85,46.53 v54.45,46.53 | IC1.94 49.9,51.48 v49.5,51.48 | IC1.9 47.73,51.03 v47.73,50.42 | IC1.13 46.32,49.62 v46.32,49.01 | IC1.31 43.89,46.18 v44.2,46.18 | IC1.45 48.84,41.23 v49.15,41.23 | IC1.59 50.91,42.2 v50.91,42.99 | IC1.63 52.33,43.61 v52.33,44.41 | 20.25,63 18.75,61.5 | R4.2 54.75,69.85 55,69.6
  Top 0.406: v40.5,22.6 40.5,23.4 39.1,24.8 U$1.34 36.59,25 34,25 33.25,25.75 26.25,25.75 23.75,23.25 21.75,23.25 | U$1.24 45.79,25.49 44.5,24.2 v44.5,22.6 | U$1.44 39.5,16.8 40.5,17.8 v40.5,18.6 | v44.5,19.4 45.5,18.4 U$1.14 49.15,18.4 51.5,20.75 51.5,21.25 53.5,23.25 54.65,23.25 Q1.4 Q1.1 58.5,27.15 R3.2 | U$1.6 42.59,17.69 v43.5,18.6 | 80.55,38.8 79.75,38 v78.25,38 | U$2.P$11 80.5,52.25 81,51.75 v81.75,51.75 | U$2.P$33 81.3,63.8 v80.5,63 | U$5.1 35.48,50.02 35,50.5 20.25,50.5 18.75,49 | U$6.1 35.48,37.52 35,38 20.25,38 18.75,39.5 18.75,49 | U$4.1 35.48,62.52 35,63 20.25,63 | 18.88,61.62 18.75,61.5 18.75,49 | 20.25,63 18.88,61.62 | JP2.28 JP2.27 18.26,61.01 18.88,61.62 | 20.25,63 35.25,63 35.75,63.5 45.75,63.5 v48,61.25 | R6.2 R5.2 24.75,17.75 21,21.5 21,22.5 21.75,23.25 | 21.75,23.25 23.69,23.25 JP7.4 | v79.75,26.75 U$3.P$11 v79.75,26.75
  Top 0.61: v48,61.25 50,63.25 Q2.4 Q2.1 50,68.6 C4.1
  Top 1.27: IC2.2 IC2.TAB 47.4,71 48.8,69.6 | 48.8,69.6 51,69.6 C4.1 | 48.8,69.6 55,69.6 55.35,69.6 v56.75,71
  Bottom 0.305: 47.38,50.07 49.15,51.83 | v44.2,46.18 44.2,46.13 C8.1
  Bottom 0.406: v79.75,26.75 78.25,28.25 v78.25,38 78.25,40.25 81.75,43.75 v81.75,51.75 81,51.75 80.5,52.25 v80.5,63 72.5,71 v56.75,71 | C9.1 50.03,42.11 v50.91,42.99 | v54.45,46.53 | v54.45,46.53 C10.1 | 47.38,50.07 47.29,50.07 C7.1
  Bottom 0.61: 44.5,18.6 44.45,18.55 | v54.45,46.53 v52.33,44.41 v50.91,42.99 v49.15,41.23 v44.2,46.18 43.84,46.53 44.16,46.84 | 44.16,46.84 v46.32,49.01 47.38,50.07 v47.73,50.42 49.15,51.83 | 49.15,51.83 v49.5,51.48 | 49.15,51.83 49.18,58.17 49.18,60.07 v48,61.25 JP3.1 | v40.5,22.6 40.5,38.5 37,42 37,49.5 39.25,51.75 44.16,46.84
  Bottom 0.813: v40.5,22.6 v40.5,18.6 42.3,18.6 | v44.5,22.6 v44.5,19.4 44.5,18.6 v43.5,18.6 42.5,18.6 | 42.3,18.6 42.5,18.6 | 42.5,18.6 42.54,18.56 | C6.1 42.34,18.56 42.3,18.6
+5V
  Top 1.27: JP1.2 37.19,70.01 C3.1 37.84,70.08 IC2.3
  Bottom 0.61: JP3.3 39.21,67.05 36.25,70.01 JP1.2
/CE1  (via drill 0.6)
  Top 0.254: v76.5,54 U$2.P$6 | IC1.100 51.5,57.32 v51.5,58.25
  Bottom 0.254: v51.5,58.25 72.25,58.25 v76.5,54
/CE2  (via drill 0.6)
  Top 0.254: U$3.P$6 v75.75,29.25 | IC1.1 47.25,57.17 47.25,57.75 47.75,58.25 v50.25,58.25
  Bottom 0.254: v50.25,58.25 51,57.5 52,57.5 52.25,57.75 71.75,57.75 75.5,54 75.5,53.75 75.75,53.5 v75.75,29.25
/LB
  Top 0.254: U$3.P$39 75.75,39.5 73.25,42 72.25,42 64.5,49.75 64.5,57.75 68,61.25 74.5,61.25 76.5,63.25 U$2.P$39 76.5,64.5 73.75,67.25 65.75,67.25 59,60.5 59,53.51 | IC1.84 59,53.51 | 59,53.51 59,53.75
/OE
  Top 0.254: U$3.P$41 74.15,39.6 72.75,41 71.75,41 63.5,49.25 63.5,58.25 67.5,62.25 74,62.25 74.9,63.15 U$2.P$41 74.9,64.6 73.25,66.25 66.25,66.25 60,60 60,53.09 | IC1.82 60,53.09 | 60,53.09 60,53.25
/RESET  (via drill 0.6)
  Top 0.305: IC1.62 55.73,39.5 v57,39.5 | 60.75,23.5 v60.75,25.5
  Top 0.406: U$1.13 49.35,17.6 52.25,20.5 52.25,21 53.75,22.5 55,22.5 56,23.5 58.65,23.5 | 58.65,23.5 R3.1 | 58.65,23.5 60.75,23.5 64,20.25 JP6.1
  Bottom 0.305: v57,39.5 60.75,35.75 v60.75,25.5
  Bottom 0.406: JP7.6 27.5,24.5 28.75,23.25 28.75,16 30,14.75 63.48,14.75 JP6.1
/UB
  Top 0.254: U$3.P$40 74.95,39.55 73,41.5 72,41.5 64,49.5 64,58 67.75,61.75 74.25,61.75 75.7,63.2 U$2.P$40 75.7,64.55 73.5,66.75 66,66.75 59.5,60.25 59.5,53.3 | IC1.83 59.5,53.3 | 59.5,53.3 59.5,53.5
/WE
  Top 0.254: U$2.P$17 85.3,52.45 88.5,49.25 89.5,49.25 96.5,42.25 96.5,34.25 93.25,31 87,31 84.55,28.55 U$3.P$17 84.55,27.3 77.5,20.25 68.75,20.25 64,25 64,27.7 IC1.57
\OE  (via drill 0.6)
  Top 0.305: U$6.22 32.95,29.05 v32.75,29.25 | U$5.22 32.95,41.7 v33,41.75 | U$4.22 32.95,54.05 v32.75,54.25
  Bottom 0.305: v32.75,54.25 33,54 v33,41.75 33,29.5 v32.75,29.25
A0
  Top 0.254: 59.02,47.89 IC1.76 59.65,48.5 60,48.5 60,45.25 70.5,34.75 70.5,28.25 71.75,27 U$3.P$1 71.75,29.75 79.5,37.5 89.75,37.5 90,37.75 90,39 86.25,42.75 85.25,42.75 81,47 79,47 77,49 75.75,49 72.5,52.25 U$2.P$1
A1
  Top 0.254: 59.02,45.33 IC1.75 70,34.42 70,32.5 | 70,32.5 70,28 71.75,26.25 72,26.25 72.5,26.75 72.5,27.45 U$3.P$2 72.55,29.8 79.75,37 90.25,37 90.5,37.25 90.5,39.25 86.5,43.25 85.5,43.25 81.25,47.5 79.25,47.5 77.25,49.5 76,49.5 73.3,52.2 U$2.P$2 | 70,32.5 70,32.75
A2
  Top 0.254: U$2.P$3 74.1,52.15 76.25,50 77.5,50 79.5,48 81.5,48 85.75,43.75 86.75,43.75 91,39.5 91,37 90.5,36.5 80,36.5 73.35,29.85 U$3.P$3 73.35,26.85 72.25,25.75 71.5,25.75 69.5,27.75 69.5,34.22 IC1.74
A3
  Top 0.254: U$2.P$4 74.9,52.1 76.5,50.5 77.75,50.5 79.75,48.5 81.75,48.5 86,44.25 87,44.25 91.5,39.75 91.5,36.75 90.75,36 80.25,36 74.15,29.9 U$3.P$4 74.15,26.9 72.5,25.25 71.25,25.25 69,27.5 69,34.01 IC1.73
A4
  Top 0.254: U$2.P$5 75.7,52.05 76.75,51 78,51 80,49 82,49 86.25,44.75 87.25,44.75 92,40 92,36.5 91,35.5 80.5,35.5 74.95,29.95 U$3.P$5 74.95,26.95 72.75,24.75 71,24.75 68.5,27.25 68.5,33.8 IC1.72
A5
  Top 0.254: U$2.P$18 86.1,52.4 88.75,49.75 89.75,49.75 97,42.5 97,34 93.5,30.5 87.25,30.5 85.35,28.6 U$3.P$18 85.35,27.35 77.75,19.75 68.5,19.75 63.5,24.75 63.5,27.49 IC1.56
A6
  Top 0.254: 89.25,30 87.5,30 86.15,28.65 U$3.P$19 86.15,27.4 78,19.25 68.25,19.25 63,24.5 63,27.28 IC1.55 | 89.25,30 89.75,30 | U$2.P$19 86.9,52.35 89,50.25 90,50.25 97.5,42.75 97.5,33.75 93.75,30 89.25,30
A7
  Top 0.254: U$2.P$20 87.7,52.3 89.25,50.75 90.25,50.75 98,43 98,33.5 94,29.5 87.75,29.5 86.95,28.7 U$3.P$20 86.95,27.45 78.25,18.75 68,18.75 62.5,24.25 62.5,27.07 IC1.54
A8
  Top 0.254: 89.25,29 88.25,29 87.75,28.5 U$3.P$21 87.75,27.5 78.5,18.25 67.75,18.25 62,24 62,26.87 IC1.53 | 89.25,29 89.75,29 | U$2.P$21 88.5,52.25 89.5,51.25 90.5,51.25 98.5,43.25 98.5,33.25 94.25,29 89.25,29
A9
  Top 0.254: U$2.P$22 89.3,52.2 89.75,51.75 90.75,51.75 99,43.5 99,33 94.5,28.5 88.5,28.5 88.5,28.05 U$3.P$22 88.5,27.5 78.75,17.75 67.5,17.75 61.5,23.75 61.5,26.66 IC1.52
A10
  Top 0.254: U$3.P$23 88.55,39.7 86,42.25 85,42.25 82,45.25 80,45.25 76.75,48.5 75.5,48.5 71,53 71,54.5 71.25,54.75 80.25,54.75 89.3,63.8 U$2.P$23 89.3,64.7 80.25,73.75 62.5,73.75 52.5,63.75 52.5,57.5 52.39,57.5 IC1.99
A11
  Top 0.254: U$3.P$24 87.75,39.75 85.75,41.75 84.75,41.75 81.75,44.75 79.75,44.75 76.5,48 75.25,48 70.5,52.75 70.5,54.75 71,55.25 80,55.25 88.5,63.75 U$2.P$24 88.5,64.75 80,73.25 62.75,73.25 53,63.5 53,57 52.75,56.75 52.34,56.75 IC1.98
A12
  Top 0.254: U$3.P$25 86.95,39.8 85.5,41.25 84.5,41.25 81.5,44.25 79.5,44.25 76.25,47.5 75,47.5 70,52.5 70,55 70.75,55.75 79.75,55.75 87.7,63.7 U$2.P$25 87.7,64.8 79.75,72.75 63,72.75 53.5,63.25 53.5,56.5 53.25,56.25 52.55,56.25 IC1.97
A13
  Top 0.254: U$3.P$26 86.15,39.85 85.25,40.75 84.25,40.75 81.25,43.75 79.25,43.75 76,47 74.75,47 69.5,52.25 69.5,55.25 70.5,56.25 79.5,56.25 86.9,63.65 U$2.P$26 86.9,64.85 79.5,72.25 63.25,72.25 54,63 54,56 53.75,55.75 52.76,55.75 IC1.96
A14
  Top 0.254: U$3.P$27 85.35,39.9 85,40.25 84,40.25 81,43.25 79,43.25 75.75,46.5 74.5,46.5 69,52 69,55.5 70.25,56.75 79.25,56.75 86.1,63.6 U$2.P$27 86.1,64.9 79.25,71.75 63.5,71.75 54.5,62.75 54.5,55.5 54.25,55.25 52.97,55.25 IC1.95
A15
  Top 0.254: U$3.P$42 73.35,39.65 72.5,40.5 71.5,40.5 63,49 63,58.5 67.25,62.75 73.5,62.75 74.1,63.35 U$2.P$42 74.1,64.65 73,65.75 66.5,65.75 60.5,59.75 60.5,52.88 | IC1.81 60.5,52.88 | 60.5,52.88 60.5,53.25
A16
  Top 0.254: U$3.P$43 72.5,39.25 72.5,39.75 72.25,40 71.25,40 62.5,48.75 62.5,58.75 67,63.25 73,63.25 73.3,63.55 U$2.P$43 73.3,64.7 72.75,65.25 66.75,65.25 61,59.5 61,51.26 | IC1.78 61,51.26 | 61,51.26 61,52.5
A17
  Top 0.254: 71.5,39.5 71.75,39.25 U$3.P$44 71.45,39.5 71,39.5 62,48.5 62,59 66.75,63.75 72.25,63.75 72.5,64 U$2.P$44 72.5,64.75 72,64.75 72,64.5 71.75,64.25 66.5,64.25 61.5,59.25 61.5,51.06 | IC1.77 61.5,51.06 | 61.5,51.06 61.5,52.5
B0  (via drill 0.6)
  Top 0.305: U$4.21 31.68,54.08 v31.5,54.25
  Bottom 0.305: v31.5,54.25 27.5,58.25 20.5,58.25 19,59.75 15.51,59.75 JP2.26
B1  (via drill 0.6)
  Top 0.305: U$4.20 30.41,54.09 v30.25,54.25
  Bottom 0.305: v30.25,54.25 26.75,57.75 20,57.75 19.25,58.5 16.8,58.5 JP2.25
B2  (via drill 0.6)
  Top 0.305: U$4.19 29.14,54.12 v29,54.25
  Bottom 0.305: v29,54.25 29,54.5 26.25,57.25 15.55,57.25 JP2.24
B3  (via drill 0.6)
  Top 0.305: U$4.18 27.86,54.13 v27.75,54.25
  Bottom 0.305: v27.75,54.25 27.75,54.75 25.75,56.75 19.5,56.75 18.75,56 16.84,56 JP2.23
B4  (via drill 0.6)
  Top 0.305: U$4.17 26.59,54.16 v26.5,54.25
  Bottom 0.305: v26.5,54.25 26.5,54.5 24.75,56.25 19.75,56.25 18.25,54.75 15.59,54.75 JP2.22
B5  (via drill 0.6)
  Top 0.305: U$4.16 25.32,54.17 v25.25,54.25
  Bottom 0.305: JP2.21 17.64,53.39 20,55.75 24.25,55.75 25.25,54.75 v25.25,54.25
B6  (via drill 0.6)
  Top 0.305: v24,54.25 24,52.3 U$4.15
  Bottom 0.305: JP2.20 14.23,50.98 15.25,52 17,52 20.25,55.25 23.5,55.25 24,54.75 v24,54.25
B7  (via drill 0.6)
  Top 0.305: U$4.14 22.79,54.22 v22.75,54.25
  Bottom 0.305: v22.75,54.25 20.5,54.25 17.25,51 16.92,51 JP2.19
B8  (via drill 0.6)
  Top 0.305: U$5.21 31.75,39.75 v31.75,41.75
  Bottom 0.305: JP2.18 14.31,48.31 15.5,49.5 18,49.5 21.75,45.75 28.5,45.75 31.75,42.5 v31.75,41.75
B9  (via drill 0.6)
  Top 0.305: U$5.20 30.5,39.75 v30.5,41.75
  Bottom 0.305: JP2.17 16.77,48.23 18.5,48.25 21.5,45.25 27.75,45.25 30.5,42.5 v30.5,41.75
B10  (via drill 0.6)
  Top 0.305: U$5.19 29,39.75 v29,41.75
  Bottom 0.305: JP2.16 14.27,45.77 15.5,47 19,47 21.25,44.75 26.75,44.75 29,42.5 v29,41.75
B11  (via drill 0.6)
  Top 0.305: U$5.18 27.75,39.75 v27.75,41.75
  Bottom 0.305: JP2.15 19.48,45.77 21,44.25 26.25,44.25 27.75,42.75 v27.75,41.75
B12  (via drill 0.6)
  Top 0.305: U$5.17 26.5,39.75 v26.5,41.75
  Bottom 0.305: JP2.14 15.5,44.5 19.75,44.5 20.5,43.75 25.5,43.75 26.5,42.75 v26.5,41.75
B13  (via drill 0.6)
  Top 0.305: U$5.16 25.25,39.75 v25.25,41.75
  Bottom 0.305: JP2.13 16.73,43.23 17.25,43.25 24.5,43.25 25.25,42.5 v25.25,41.75
B14  (via drill 0.6)
  Top 0.305: U$5.15 24,39.75 v24,41.75
  Bottom 0.305: JP2.12 14.23,40.73 15.5,42 19.75,42 20.5,42.75 23.75,42.75 24,42.5 v24,41.75
B15  (via drill 0.6)
  Top 0.305: U$5.14 22.75,39.75 v22.75,41.75
  Bottom 0.305: JP2.11 16.96,40.5 19.75,40.5 21,41.75 v22.75,41.75
B16  (via drill 0.6)
  Top 0.305: U$6.21 31.68,29.07 v31.5,29.25
  Bottom 0.305: JP2.10 14.23,38.23 15.5,39.5 17.5,39.5 18.25,38.75 18.25,37.5 22,33.75 27.75,33.75 31.5,30 v31.5,29.25
B17  (via drill 0.6)
  Top 0.305: U$6.20 30.41,29.09 v30.25,29.25
  Bottom 0.305: JP2.9 16.85,38.15 21.75,33.25 27,33.25 30.25,30 v30.25,29.25
B18  (via drill 0.6)
  Top 0.305: U$6.19 29.14,29.11 v29,29.25
  Bottom 0.305: JP2.8 14.23,35.73 15.25,36.75 17.5,36.75 21.5,32.75 26.25,32.75 29,30 v29,29.25
B19  (via drill 0.6)
  Top 0.305: U$6.18 27.86,29.14 v27.75,29.25
  Bottom 0.305: JP2.7 17.89,35.61 21.25,32.25 25.5,32.25 27.75,30 v27.75,29.25
B20  (via drill 0.6)
  Top 0.305: U$6.17 26.59,29.16 v26.5,29.25
  Bottom 0.305: JP2.6 14.23,33.23 15.25,34.25 18.5,34.25 21,31.75 24.75,31.75 26.5,30 v26.5,29.25
B21  (via drill 0.6)
  Top 0.305: U$6.16 25.32,29.18 v25.25,29.25
  Bottom 0.305: JP2.5 17.18,33.07 18,32.25 19.75,32.25 20.75,31.25 24,31.25 25.25,30 v25.25,29.25
B22  (via drill 0.6)
  Top 0.305: U$6.15 24.05,29.2 v24,29.25
  Bottom 0.305: JP2.4 14.28,30.53 15.5,31.75 19.5,31.75 20.5,30.75 23.25,30.75 24,30 v24,29.25
B23  (via drill 0.6)
  Top 0.305: U$6.14 22.79,29.21 v22.75,29.25
  Bottom 0.305: v22.75,29.25 21.72,30.28 17.02,30.28 JP2.3
D1
  Top 0.254: U$2.P$7 77.3,52.45 80.25,49.5 82.25,49.5 86.5,45.25 87.5,45.25 92.5,40.25 92.5,36.25 91.25,35 82.5,35 76.55,29.05 U$3.P$7 76.55,27.05 73.75,24.25 70.75,24.25 68,27 68,33.6 IC1.71
D2
  Top 0.254: U$2.P$8 78.1,52.4 80.5,50 82.5,50 86.75,45.75 87.75,45.75 93,40.5 93,36 91.5,34.5 82.75,34.5 77.35,29.1 U$3.P$8 77.35,27.1 74,23.75 70.5,23.75 67.5,26.75 67.5,33.39 IC1.70
D3
  Top 0.254: U$2.P$9 78.9,52.35 80.75,50.5 82.75,50.5 87,46.25 88,46.25 93.5,40.75 93.5,35.75 91.75,34 83,34 78.15,29.15 U$3.P$9 78.15,27.15 74.25,23.25 70.25,23.25 67,26.5 67,33.18 IC1.69
D4
  Top 0.254: U$2.P$10 79.7,52.3 81,51 83,51 87.25,46.75 88.25,46.75 94,41 94,35.5 92,33.5 83.25,33.5 78.95,29.2 U$3.P$10 78.95,27.2 74.5,22.75 70,22.75 66.5,26.25 66.5,32.97 IC1.68
D5
  Top 0.254: U$2.P$13 82.1,52.65 87.5,47.25 88.5,47.25 94.5,41.25 94.5,35.25 92.25,33 86,33 81.35,28.35 U$3.P$13 81.35,27.1 76.5,22.25 69.75,22.25 66,26 66,32.77 IC1.67
D6
  Top 0.254: 89.5,32.5 86.25,32.5 82.15,28.4 U$3.P$14 82.15,27.15 76.75,21.75 69.5,21.75 65.5,25.75 65.5,32.56 IC1.66 | 89.5,32.5 89.75,32.5 | U$2.P$14 82.9,52.6 87.75,47.75 88.75,47.75 95,41.5 95,35 92.5,32.5 89.5,32.5
D7
  Top 0.254: U$2.P$15 83.7,52.55 88,48.25 89,48.25 95.5,41.75 95.5,34.75 92.75,32 86.5,32 82.95,28.45 | 82.95,28.45 U$3.P$15 | 82.95,28.45 82.95,27.2 77,21.25 69.25,21.25 65,25.5 65,30.02 IC1.61
D8
  Top 0.254: U$2.P$16 84.5,52.5 88.25,48.75 89.25,48.75 96,42 96,34.5 93,31.5 86.75,31.5 83.75,28.5 U$3.P$16 83.75,27.25 77.25,20.75 69,20.75 64.5,25.25 64.5,27.9 IC1.58
D9
  Top 0.254: U$3.P$29 83.75,39.75 80.75,42.75 78.75,42.75 75.5,46 74.25,46 68.5,51.75 68.5,55.75 70,57.25 78,57.25 84.5,63.75 U$2.P$29 84.5,64.5 77.75,71.25 63.75,71.25 55,62.5 55,55.16 | IC1.92 55,55.16 | 55,55.16 55,55.5
D10
  Top 0.254: U$3.P$30 82.95,39.8 80.5,42.25 78.5,42.25 75.25,45.5 74,45.5 68,51.5 68,56 69.75,57.75 77.75,57.75 83.7,63.7 U$2.P$30 83.7,64.55 77.5,70.75 64,70.75 55.5,62.25 55.5,54.96 IC1.91
D11
  Top 0.254: U$3.P$31 82.15,39.85 80.25,41.75 78.25,41.75 75,45 73.75,45 67.5,51.25 67.5,56.25 69.5,58.25 77.5,58.25 82.9,63.65 U$2.P$31 82.9,64.6 77.25,70.25 64.25,70.25 56,62 56,54.75 IC1.90
D12
  Top 0.254: U$3.P$32 81.35,39.9 80,41.25 78,41.25 74.75,44.5 73.5,44.5 67,51 67,56.5 69.25,58.75 77.25,58.75 82.1,63.6 U$2.P$32 82.1,64.65 77,69.75 64.5,69.75 56.5,61.75 56.5,54.54 IC1.89
D13
  Top 0.254: 78.38,62.12 75.5,59.25 69,59.25 66.5,56.75 66.5,50.75 73.25,44 74.5,44 78.95,39.55 U$3.P$35 | 78.38,62.12 78.5,62.25 | 78.38,62.12 79.7,63.45 U$2.P$35 79.7,64.55 75,69.25 64.75,69.25 57,61.5 57,54.34 IC1.88
D14
  Top 0.254: IC1.87 57.5,54.13 57.5,61.25 65,68.75 74.75,68.75 78.9,64.6 U$2.P$36 78.9,63.4 75.25,59.75 68.75,59.75 66,57 66,50.5 73,43.5 74.25,43.5 78.15,39.6 U$3.P$36
D15
  Top 0.254: U$3.P$37 77.35,39.65 74,43 72.75,43 65.5,50.25 65.5,57.25 68.5,60.25 75,60.25 78.1,63.35 U$2.P$37 78.1,64.65 74.5,68.25 65.25,68.25 58,61 58,53.92 IC1.86
D16
  Top 0.254: U$3.P$38 76.55,39.7 73.75,42.5 72.5,42.5 65,50 65,57.5 68.25,60.75 74.75,60.75 77.3,63.3 U$2.P$38 77.3,64.7 74.25,67.75 65.5,67.75 58.5,60.75 58.5,53.71 IC1.85
DIR  (via drill 0.6)
  Top 0.305: IC1.2 44.47,59.25 34.5,59.25 34.25,59.5 v34.22,59.78 U$4.2 | U$6.2 34.22,34.78 v34.25,34.75 | U$5.2 34.22,47.53 34.25,47.5 v34.25,47.25
  Bottom 0.305: 34.25,59.72 v34.25,47.25 v34.25,34.75 | 34.25,59.72 34.22,59.75 | 34.25,59.72 34.25,59.75 v34.22,59.78
GND  (via drill 0.6, 1)
  Top 0.254: 80.55,29.2 v80.5,29.25
  Top 0.305: IC1.79 56.57,47.54 v56.57,46.53 | IC1.65 54.1,43.26 v54.1,44.06 | IC1.60 52.33,41.49 v52.33,42.29 | IC1.46 47.78,39.46 v48.79,39.46 | IC1.32 42.83,44.41 v43.84,44.41 | IC1.10 46.32,51.74 v46.32,51.13 46.23,51.13 IC1.11 | IC1.93 51.62,52.49 v51.62,51.48
  Top 0.406: U$1.43 38.7,17.6 v38.9,17.8 | v38.9,23.4 38.7,24 U$1.35 34,24 33.48,24.52 JP7.10 | U$1.15 46.3,19.2 v46.1,19.4 | U$1.23 46.59,24.69 v46.1,24.2 | U$1.5 41.79,16.31 v41.1,17 | U$3.P$12 80.55,29.2 | U$3.P$34 v79.75,40.25 | U$2.P$12 81.3,53.8 v81.75,54.25 | U$2.P$34 80.5,65 v80,65.5 | U$4.13 20.5,52.25 v20.25,52 | v20.5,49 20.75,49 21,48.75 U$5.12 | U$5.13 20.75,39.75 v20.25,39.5 | v20.5,36.5 20.75,36.25 U$6.12
  Top 1.27: C5.- 13.51,75.29 | C2.2 20.32,72.8
  Bottom 0.254: v80,65.5 79.75,65.75
  Bottom 0.406: v20.25,52 20.25,49.25 v20.5,49 | v20.25,39.5 20.25,36.75 v20.5,36.5
  Bottom 0.813: C6.2 42.34,17.04 42.3,17
  Bottom 1.27: X2.2 8.41,74.41 v10,76
  other vias: 60,73.25 83.75,73 87,57.5 90.5,25.75 53,32.25
  pour Bottom: 57.99,46.53 49.15,37.69 40.31,46.53 49.15,55.37
  pour Bottom: 99.5,17.25 52.5,17.25 52.5,67.5 59.5,74 99.5,74
  pour Bottom: 38.25,25.25 47,25.25 47,16.5 38.25,16.5
  pour Top: 0.75,79.25 99.25,79.25 99.25,10.75 0.75,10.5
  pour Bottom: 38.25,25.25 38.25,45.25 52.5,45.25 52.5,17 52.5,16.5 39.25,16.5
IA0
  Top 0.305: U$4.3 32.95,59.05 33.25,58.75 44.26,58.75 IC1.3
IA1
  Top 0.305: U$4.4 31.68,58.83 32.25,58.25 44.05,58.25 IC1.4
IA2
  Top 0.305: U$4.5 30.41,58.84 31.5,57.75 43.85,57.75 IC1.5
IA3
  Top 0.305: U$4.6 29.14,58.87 30.75,57.25 43.64,57.25 IC1.6
IA4
  Top 0.305: U$4.7 27.86,58.88 30,56.75 43.43,56.75 IC1.7
IA5
  Top 0.305: U$4.8 26.59,58.91 29.25,56.25 43.22,56.25 IC1.8
IA6
  Top 0.305: U$4.9 25.32,58.92 28.5,55.75 38.77,55.75 IC1.15
IA7
  Top 0.305: U$4.10 24.05,58.95 27.75,55.25 38.57,55.25 IC1.16
IA8
  Top 0.305: U$5.3 32.95,46.8 33.5,46.25 35.5,46.25 36.25,47 36.25,51.5 37.5,52.75 40.36,52.75 IC1.17
IA9
  Top 0.305: U$5.4 31.68,46.83 32.75,45.75 35.75,45.75 36.75,46.75 36.75,51.25 37.75,52.25 40.15,52.25 IC1.18
IA10
  Top 0.305: U$5.5 30.41,46.84 32,45.25 36,45.25 37.25,46.5 37.25,51 38,51.75 39.95,51.75 IC1.19
IA11
  Top 0.305: U$5.6 29.14,46.87 31.25,44.75 36.25,44.75 37.75,46.25 37.75,50.75 38.25,51.25 39.74,51.25 IC1.20
IA12
  Top 0.305: U$5.7 27.86,46.88 30.5,44.25 36.5,44.25 38.25,46 38.25,50.5 38.5,50.75 39.53,50.75 IC1.21
IA13
  Top 0.305: U$5.8 26.59,46.91 29.75,43.75 37.93,43.75 IC1.26
IA14
  Top 0.305: U$5.9 25.32,46.92 29,43.25 38.14,43.25 IC1.27
IA15
  Top 0.305: U$5.10 24.05,46.95 28.25,42.75 38.34,42.75 IC1.28
IA16
  Top 0.305: U$6.3 32.95,34.3 33.5,33.75 36.25,33.75 38.5,36 38.5,42.2 IC1.29
IA17
  Top 0.305: U$6.4 31.68,33.83 32.25,33.25 36.5,33.25 39,35.75 39,41.99 IC1.30
IA18
  Top 0.305: U$6.5 30.41,33.09 30.75,32.75 36.75,32.75 39.5,35.5 39.5,40.37 IC1.33
IA19
  Top 0.305: U$6.6 29.14,33.12 30,32.25 37,32.25 40,35.25 40,40.16 IC1.34
IA20
  Top 0.305: U$6.7 27.86,33.13 29.25,31.75 37.25,31.75 40.5,35 40.5,39.96 IC1.35
IA21
  Top 0.305: U$6.8 26.59,33.16 28.5,31.25 37.5,31.25 41,34.75 41,39.75 IC1.36
IA22
  Top 0.305: U$6.9 25.32,33.17 27.75,30.75 37.75,30.75 41.5,34.5 41.5,39.54 IC1.37
IA23
  Top 0.305: U$6.10 24.05,33.2 27,30.25 38,30.25 42,34.25 42,39.34 IC1.38
N$2
  Top 0.406: X3.2 10.25,46.5 11,45.75 11,38.74 R2.1
N$3
  Top 0.406: U$1.3 40.19,13.69 40,13.5 24,13.5 9.69,27.81 R2.2
N$4
  Top 0.406: X3.3 9.8,45.7 10.25,45.25 10.25,40.75 R1.1
N$5
  Top 0.406: R1.2 6.93,33.82 9,31.75 9,27.5 23.75,12.75 40.25,12.75 40.99,13.49 U$1.4
N$6
  Top 1.27: IC3.2 IC3.TAB 33.39,72.41 JP1.1
N$7  (via drill 0.6)
  Top 0.305: IC1.23 41.62,47.25 v41.75,47.25
  Bottom 0.305: v41.75,47.25 41.75,46.25 41,45.5 39.25,45.5 38.75,45 38.75,42.75 59.02,22.48 JP5.3
N$8
  Top 1.27: D1.C 12.14,65.94 C5.+ 13.39,66.99 16,69.6 20.16,69.6 C2.1 20.66,70.1 IC3.3
N$9  (via drill 0.6)
  Top 0.305: IC1.22 41.33,48.25 42.5,48.25 42.75,48 v42.75,46.5
  Bottom 0.305: v42.75,46.5 41.25,45 39.75,45 39.25,44.5 39.25,43 | 39.25,43 39.25,42.75 | JP5.1 61.48,20.77 39.25,43
N$10  (via drill 0.6)
  Top 0.305: IC1.24 40.75,47.41 v40.75,46.5
  Bottom 0.305: v40.75,46.5 38.75,46.5 38.25,46 38.25,42.5 56.5,24.25 56.5,20.79 JP5.5
N$11  (via drill 0.6)
  Top 0.305: IC1.25 38.75,48.7 38.75,49.5 39,49.75 v39.25,49.75
  Bottom 0.305: v39.25,49.75 37.75,48.25 37.75,42.25 53.75,26.25 53.75,20.96 JP5.7
N$12  (via drill 0.6)
  other vias: 81.75,51.75
N$13
  Top 0.406: U$1.39 34.05,20.8 32.5,19.25 25.15,19.25 JP7.1
N$14
  Top 0.406: U$1.36 26.18,23.2 JP7.3
N$15
  Top 0.406: U$1.38 33.85,21.6 32.25,20 29.48,20 JP7.5
N$16
  Top 0.406: U$1.37 33,22.4 JP7.9
N$17  (via drill 0.6)
  other vias: 34.25,47.25
N$18  (via drill 0.6)
  other vias: 39.25,49.75
N$19  (via drill 0.6)
  other vias: 34.25,34.75
N$20  (via drill 0.6)
  other vias: 40.75,46.5
N$21  (via drill 0.6)
  other vias: 41.75,47.25
N$22  (via drill 0.6)
  other vias: 42.75,46.5
N$23
  Top 0.406: U$1.17 49.7,20.8 Q1.3
N$24  (via drill 0.6)
  Top 0.305: IC1.12 43.5,53.15 43.5,54.5 v43,55 | v47.5,63.5 Q2.3
  Bottom 0.305: v43,55 43,62.5 44,63.5 v47.5,63.5
N$25
  Top 0.813: LED1.A 53.67,72.82 R4.1
N$26
  Top 0.406: LED2.C 33.17,18.92 34.25,20 U$1.40
N$27
  Top 0.406: U$1.41 35.7,19.2 35,18.5 35,17.08 LED3.C
N$28
  Top 0.406: R5.1 LED2.A
N$29
  Top 0.406: R6.1 LED3.A
PD0
  Top 0.305: IC1.51 51.25,36.2 51.25,35.5 50.75,35 47,35 46.5,34.5 46.5,30.25 46.75,30 49.5,30 51.5,28 51.5,23.5 49.5,21.5 48.49,21.5 U$1.18
PD1
  Top 0.305: IC1.50 46,34.85 46,30 46.5,29.5 49.25,29.5 51,27.75 51,23.75 49.75,22.5 48.49,22.5 U$1.19
PD2
  Top 0.305: IC1.49 45.5,35.06 45.5,29.75 46.25,29 49,29 50.5,27.5 50.5,24.25 49.5,23.25 48.44,23.25 U$1.20
PD3
  Top 0.305: IC1.48 45,35.26 45,29.5 46,28.5 48.75,28.5 50,27.25 50,24.75 49.25,24 U$1.21
PD4
  Top 0.305: IC1.42 44,38.51 44,28.5 44.99,27.51 U$1.25
PD5
  Top 0.305: IC1.47 44.5,35.47 44.5,29.25 45.75,28 48.5,28 49.5,27 49.5,25.25 49.05,24.8 U$1.22
PD6
  Top 0.305: IC1.41 43.5,38.71 43.5,28.25 44.19,27.56 U$1.26
PD7
  Top 0.305: IC1.40 43,38.92 43,30.75 | 43,30.75 43,30.25 | U$1.27 43.39,27.61 43,28 43,30.75
PD_CLK  (via drill 0.6, 1)
  Top 0.305: IC1.14 42.25,52.98 v42.25,54 | U$1.32 39.39,28.36 38.5,29.25 v37.25,29.25
  Bottom 0.305: v42.25,54 42.25,54.5 41.75,55 38.5,55 37.5,54 | 37.5,54 37.25,53.75 | v37.25,29.25 37.25,40.75 36.25,41.75 36.25,52.75 37.5,54
PD_INT
  Top 0.305: IC1.39 42.5,39.13 42.5,27.75 42.59,27.66 U$1.28
TCK
  Top 0.406: U$1.9 44.99,13.51 46.25,12.25 52.5,12.25 56.5,16.25 56.5,18.21 JP5.6
TDI  (via drill 1)
  Top 0.406: U$1.10 45.79,13.71 46.5,13 51.25,13 v53.75,15.5
  Bottom 0.406: v53.75,15.5 58.25,15.5 59,16.25 59,18.21 JP5.4
TDO
  Top 0.406: U$1.11 46.59,13.91 46.75,13.75 49.46,13.75 JP5.8
TMS
  Top 0.406: U$1.12 49.55,16.8 52.25,19.5 60.29,19.5 JP5.2
V+
  Bottom 1.27: X2.1 3.4,74.42 D1.A
VCC  (via drill 1)
  Top 0.406: U$1.7 43.39,13.89 42.75,13.25 41.75,13.25 40.5,12 23.5,12 8.25,27.25 8.25,30.5 5.25,33.5 5.25,35.75 5.5,36 11.25,36 11.75,36.5 11.75,46.25 10.9,47.1 C1.2 10.4,47.3 X3.1 6.2,47.3 v5,48.5
  Bottom 0.406: JP1.3 17.97,67.47 10.75,60.25 10.75,56.25 5,50.5 v5,48.5
VCCIO  (via drill 0.6)
  Top 0.406: v35.5,54.25 35.5,52.27 U$4.24 35.48,54.23 v35.5,54.25 | v35.5,54.25 34.75,54.25 34.25,53.75 34.25,52.28 U$4.23 | U$5.23 34.22,41.22 34.75,41.75 v35.5,41.75 | v35.5,41.75 35.5,39.77 U$5.24 35.48,41.73 v35.5,41.75 | U$6.23 34.22,28.71 34.75,29.25 v35.5,29.25 | v35.5,29.25 35.5,27.27 U$6.24 35.48,29.23 v35.5,29.25
  Bottom 0.406: JP3.2 41.75,60.5 v35.5,54.25 v35.5,41.75 v35.5,29.25

### Text on the board
Top: PWR | PWR | EXT | Andreas Mueller HSA | USB | I/O-VOLT. | 5V | 3.3V | + | + | 1 | 24 | - | 48M | - | MEGA | JTAG | reset | CPLD | JTAG | USB-TPLE V 1.0